# Altium schematic sheet ina226.SchDoc
size A4; SheetNumber: 1; SheetTotal: 1
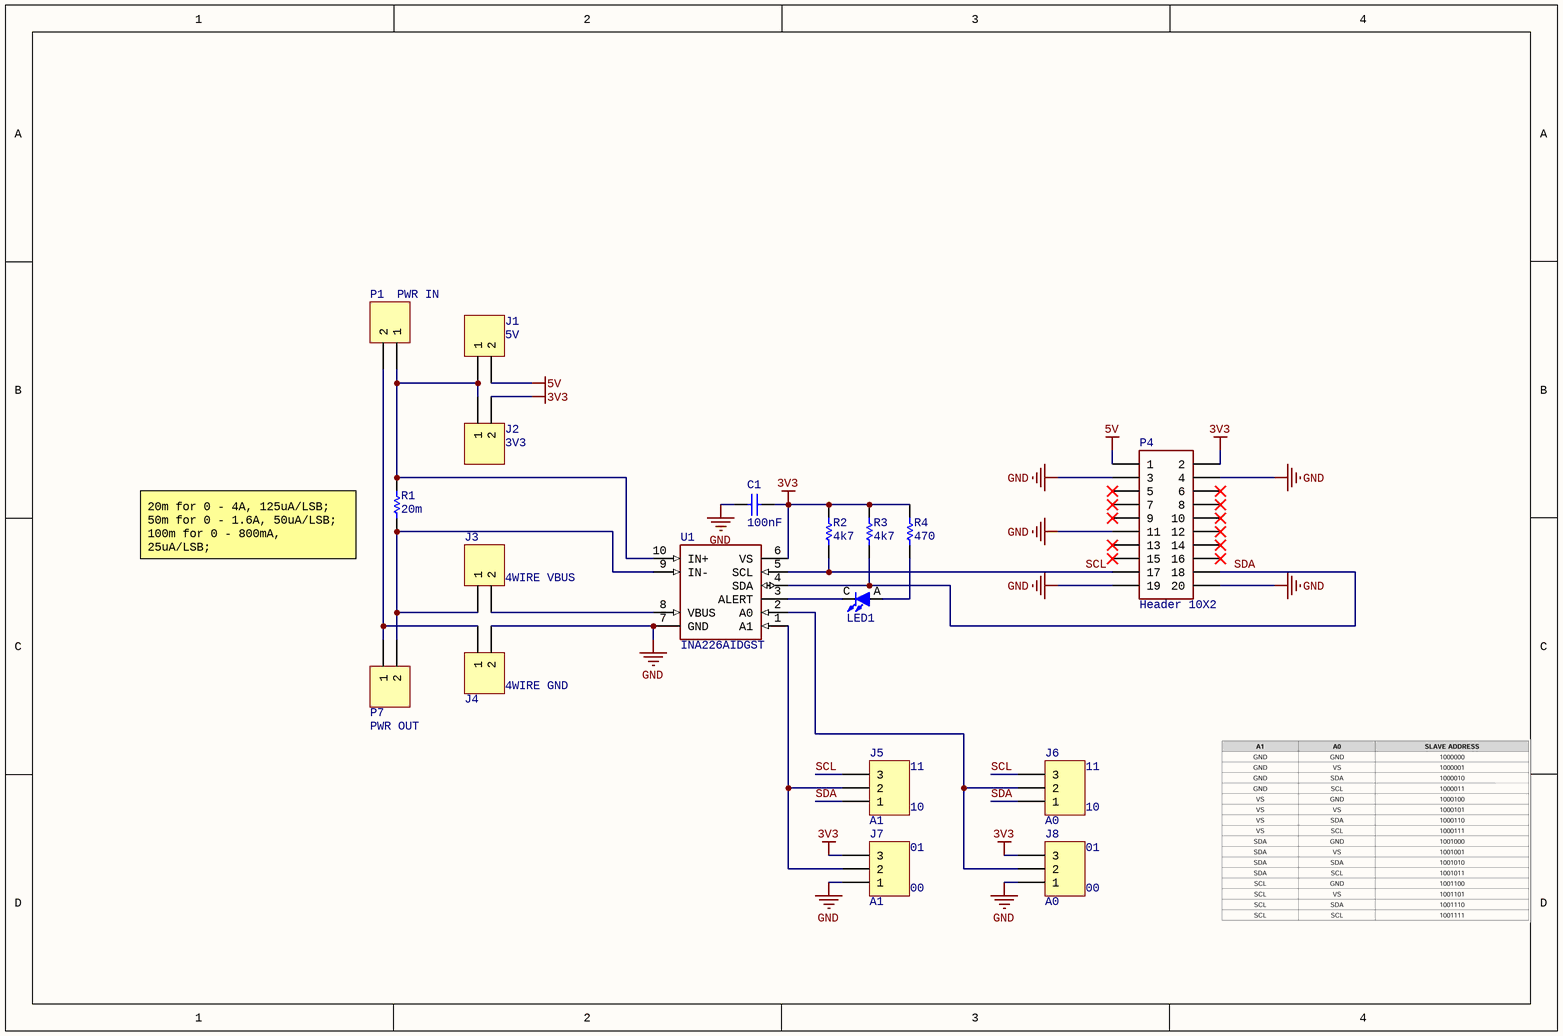
[diagram p0: ina226.SchDoc]

## Parts
C1  100nF  [CAPC100X50X55L25N]
J1  5V  [HDR1X2]
J2  3V3  [HDR1X2]
J3  4WIRE VBUS  [HDR1X2]
J4  4WIRE GND  [HDR1X2]
J5  A1  [HDR1X3]
J6  A0  [HDR1X3]
J7  A1  [HDR1X3]
J8  A0  [HDR1X3]
LED1  蓝灯 正贴  [LEDC100X50X45L25N]  (value not drawn)
P1  PWR IN  [CONN-TH_P3.50_KF250-3.5-2P-1]
P4  Header 10X2  [HDRV20W63P254_10X2_2540X508H860]
P7  PWR OUT  [CONN-TH_P3.50_KF250-3.5-2P-1]
R1  20m  [RESC620X325X80L80N-K]
R2  4k7  [RESC100X50X35L25N]
R3  4k7  [RESC100X50X35L25N]
R4  470  [RESC100X50X35L25N]
U1  INA226AIDGST  [DGS0010A_N]

## Nets
3V3: C1.2 J2.2 J7.3 J8.3 P4.2 R2.2 R3.2 R4.2 U1.6(VS)
5V: J1.2 P4.1
GND: C1.1 J4.2 J7.1 J8.1 P4.3 P4.4 P4.11 P4.19 P4.20 U1.7(GND)
SCL: J5.3 J6.3 P4.17 R2.1 U1.5(SCL)
SDA: J5.1 J6.1 P4.18 R3.1 U1.4(SDA)
NetJ1_1: J1.1 J2.1 P1.1 R1.2 U1.10(IN+)
NetJ3_1: J3.1 P7.2 R1.1 U1.9(IN-)
NetJ3_2: J3.2 U1.8(VBUS)
NetJ4_1: J4.1 P1.2 P7.1
NetJ5_2: J5.2 J7.2 U1.1(A1)
NetJ6_2: J6.2 J8.2 U1.2(A0)
NetLED1_A: LED1.A R4.1
NetLED1_C: LED1.C(K) U1.3(ALERT)

Not connected (* = marked no-connect by the designer): P4 5* 6* 7* 8* 9* 10* 12* 13* 14* 15* 16*

## Notes on the sheet
- (near R1) 20m for 0 - 4A, 125uA/LSB;
  50m for 0 - 1.6A, 50uA/LSB;
  100m for 0 - 800mA, 25uA/LSB;
  200m for 0 - 400mA, 12.5uA/LSB
- (near J5) 11
- (near J6) 11
- 01
- 10
- (near J7) 00
- (near J8) 00

## Library data of the parts
C1 = Cap Semi: Capacitor (Semiconductor SIM Model); Published: 8-Jun-2000; LatestRevisionDate: 29-May-2009; LatestRevisionNote: IPC-7351 Footprint Added.; PackageReference: C1206; Publisher: Altium Limited; PackageDescription: Chip Capacitor; Value: 100nF
J1-J4 P1 P7 = Header 2: Header, 2-Pin; LatestRevisionDate: 17-Jul-2002; LatestRevisionNote: Re-released for DXP Platform.; Publisher: Altium Limited
J5-J8 = Header 3: Header, 3-Pin; LatestRevisionDate: 17-Jul-2002; LatestRevisionNote: Re-released for DXP Platform.; Publisher: Altium Limited
LED1 = LED-SMD: 贴片LED; 编号: C965795
P4 = Header 10X2: Header, 10-Pin, Dual row; 编号: C5116480
R1 = Res1: Resistor; PackageDescription: Axial Device, Thru-Hole; 2 Leads; 0.3 in Pin Spacing
R2-R4 = Res1: Resistor; Value: 1K; Published: 8-Jun-2000; LatestRevisionDate: 17-Jul-2002; LatestRevisionNote: Re-released for DXP Platform.; PackageReference: AXIAL-0.3; Publisher: Altium Limited; PackageDescription: Axial Device, Thru-Hole; 2 Leads; 0.3 in Pin Spacing
U1 = CMP-0704-00057-2: High-Side Measurement, Bi-Directional Current / Power Monitor with I2C Interface, 2.7 to 5.5 V, -40 to 125 degC, 10-pin SOP (DGS10), Green (RoHS & no Sb/Br); Quiescent Current (+/-)(Typ)(mA): 0.33; Common Mode Range(Max)(V): 36; Input Offset (+/-)(Max)(uV): 10; Vs(Min)(V): 2.7; Common Mode Range(Min)(V): 0; Rating: Catalog; CMRR(Min)(dB): 126; Input Offset Drift (+/-)(Max)(uV/Degrees Celsius): 0.1; SubFamily: Current Shunt Monitor; Small-Signal Bandwidth(Typ)(MHz): 0.007; Gain(V/V): 1; Vs(Max)(V): 5.5; PartNumber: INA226AIDGST; ComponentLink3Description: Package Specification; ComponentLink3URL: http://www.ti.com/lit/ml/mpds035b/mpds035b.pdf; PackageReference: DGS0010A; Mounting Technology: Surface Mount; ComponentLink2URL: http://www.ti.com/general/docs/lit/getliterature.tsp?genericPartNumber=INA226&fileType=pdf; ComponentLink1URL: http://www.ti.com/; Code_JEDEC: MO-153; Eco-Plan: Green (RoHS & no Sb/Br); DatasheetVersion: SBOS547; PackageDescription: 10-Pin Plastic Small Outline, Body 3 x 3 mm, Pitch 0.5 mm; ComponentLink2Description: Datasheet; ComponentLink1Description: Manufacturer URL; PackageVersion: 4073272/C, 02/2004